# Altium schematic sheet PowerElectronics.SchDoc
size 381 x 241 mm; SheetNumber: 1; SheetTotal: 4
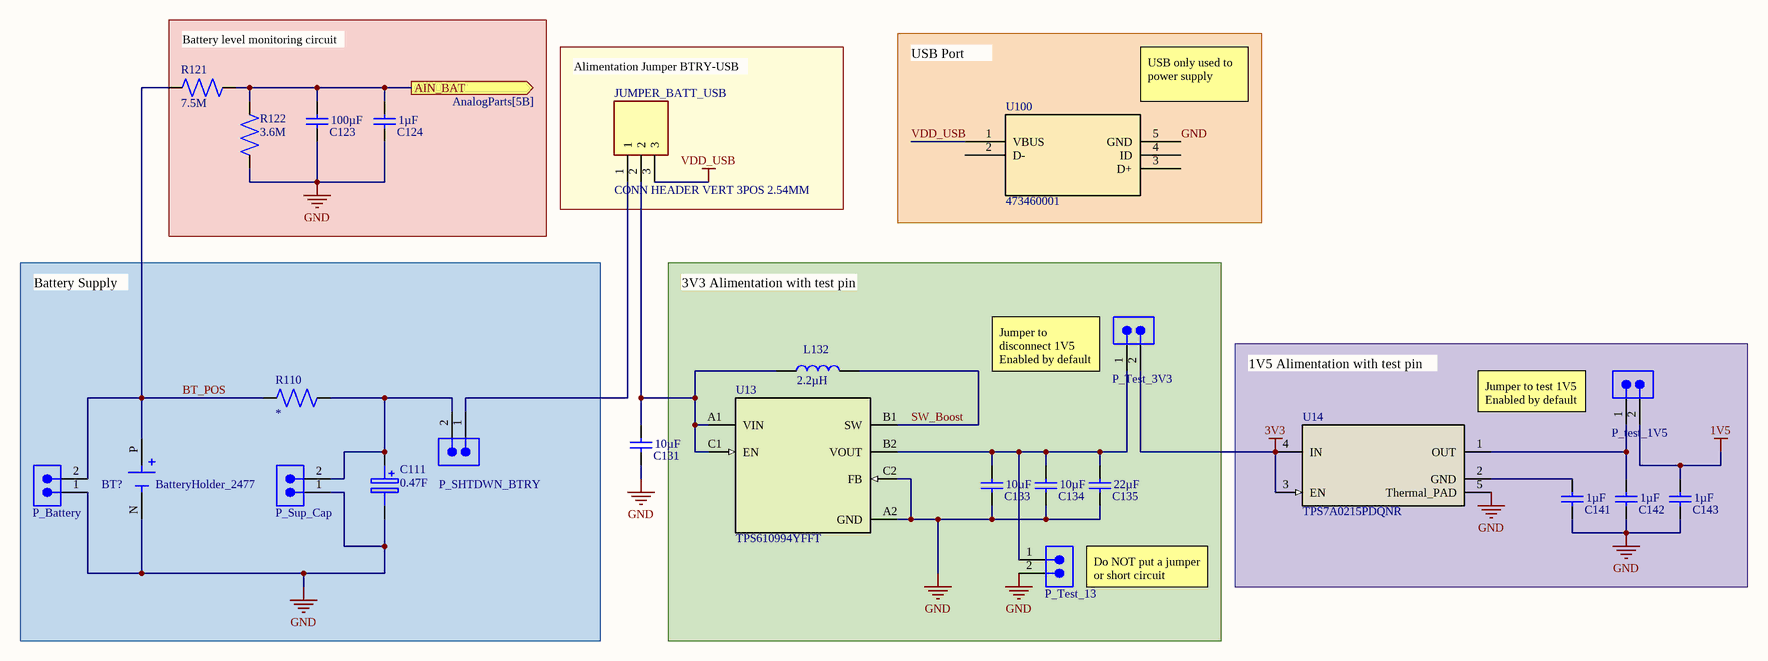
[diagram p0: PowerElectronics.SchDoc]

## Parts
BT?  BatteryHolder_2477  [BatteryHolder2477]
C111  0.47F  [TH_SUPCAP_PHVL3R9V474R]
C123  100µF  [CAPC1608X06L]
C124  1µF  [CAPC1608X06L]
C131  10µF  [CAPC1608X06L]
C133  10µF  [CAPC1608X06L]
C134  10µF  [CAPC1608X06L]
C135  22µF  [CAPC1608X06L]
C141  1µF  [CAPC1608X06L]
C142  1µF  [CAPC1608X06L]
C143  1µF  [CAPC1608X06L]
JUMPER_BATT_USB  CONN HEADER VERT 3POS 2.54MM  [CONN HEADER VERT 3POS 2.54MM]
L132  2.2µH  [INDC2016X10CX]
P_Battery  Pin header 2p  [Pin_header_1x2]  (value not drawn)
P_SHTDWN_BTRY  Pin header 2p  [Pin_header_1x2]  (value not drawn)
P_Sup_Cap  Pin header 2p  [Pin_header_1x2]  (value not drawn)
P_test_1V5  Pin header 2p  [Pin_header_1x2]  (value not drawn)
P_Test_3V3  Pin header 2p  [Pin_header_1x2]  (value not drawn)
P_Test_13  Pin header 2p  [Pin_header_1x2]  (value not drawn)
R110  *  [RESC1608X04.5L]
R121  7.5M  [RESC1608X04.5L]
R122  3.6M  [RESC1608X04.5L]
U13  TPS610994YFFT  [YFF0006AFAD]
U14  TPS7A0215PDQNR  [DQN0004A-MFG]
U100  473460001  [47346-0001_MOL]

## Ports
AIN_BAT (out, see AnalogParts[5B])

## Nets
1V5: C143.2 P_test_1V5.2
3V3: P_Test_3V3.2 U14.3(EN) U14.4(IN)
GND: BT?.N(NEG) C111.1(-) C123.1 C124.1 C131.1 C133.1 C134.1 C135.1 C141.1 C142.1 C143.1 P_Battery.1 P_Sup_Cap.1 P_Test_13.2 R122.2 U13.A2(GND) U13.C2(FB) U14.5(Thermal_PAD) U100.5(GND)
VDD_USB: JUMPER_BATT_USB.3 U100.1(VBUS)
AIN_BAT: C123.2 C124.2 R121.2 R122.1 ; port AIN_BAT
BT_POS: BT?.P(POS) P_Battery.2 R110.1 R121.1
SW_Boost: L132.2 U13.B1(SW)
NetC111_2: C111.2(+) P_SHTDWN_BTRY.2 P_Sup_Cap.2 R110.2
NetC131_2: C131.2 JUMPER_BATT_USB.2 L132.1 U13.A1(VIN) U13.C1(EN)
NetC133_2: C133.2 C134.2 C135.2 P_Test_3V3.1 P_Test_13.1 U13.B2(VOUT)
NetC141_2: C141.2 U14.2(GND)
NetC142_2: C142.2 P_test_1V5.1 U14.1(OUT)
NetJUMPER_BATT_USB_1: JUMPER_BATT_USB.1 P_SHTDWN_BTRY.1

Not connected (* = marked no-connect by the designer): U100 2(D-) 3(D+) 4(ID)

## Notes on the sheet
- (near R121) Battery level monitoring circuit
- Alimentation Jumper BTRY-USB
- USB Port
- (near U100) USB only used to power supply
- Battery Supply
- 3V3 Alimentation with test pin
- (near P_Test_3V3) Jumper to disconnect 1V5
  Enabled by default
- 1V5 Alimentation with test pin
- Jumper to test 1V5
  Enabled by default
- Do NOT put a jumper or short circuit

## Library data of the parts
BT? = BatteryHolder_2477: Battery holder for coin battery, modello BH1000G; Value: BatteryHolder_2477
C111 = PHVL-3R9V474-R: Supercapacitors 0.47F, 3.9V working voltage, 5V surge voltage, 1µA leak current; Value: 0.47F
C123 C124 C131 C133-C135 = C0603-4µ7: Capacitor, X5R, ±10%; Value: 4.7µF
C141-C143 = C0603-4µ7: Capacitor, X5R, ±10%; Value: 1µF
JUMPER_BATT_USB = CONN HEADER VERT 3POS 2.54MM: Connector; Manufacturer_Name: Wurth Elektronik; Manufacturer_Part_Number: 61300311121; Datasheet Link: http://katalog.we-online.de/em/datasheet/6130xx11121.pdf; Height: 8.69mm; Mouser Part Number: 710-61300311121; Mouser Price/Stock: https://www.mouser.co.uk/ProductDetail/Wurth-Elektronik/61300311121?qs=PhR8RmCirEYxRWFJzNKsUw%3D%3D
L132 = L0806-2µ2-1.53A-163mOhm-TDK: Shielded wirewound Inductor 1.53 A 163mOhm, ±20%; MF: TDK Corporation; MP: VLS201610CX-2R2M-1; Check_prices: https://www.snapeda.com/parts/VLS201610CX-2R2M-1/TDK/view-part/?ref=eda; Price: None; Availability: In Stock; SnapEDA_Link: https://www.snapeda.com/parts/VLS201610CX-2R2M-1/TDK/view-part/?ref=snap; Value: 2.2µH; Package: NON STANDARD-2 TDK; Purchase-URL: https://pricing.snapeda.com/search/part/VLS201610CX-2R2M-1/?ref=eda
P_Battery P_SHTDWN_BTRY P_Sup_Cap P_test_1V5 P_Test_3V3 P_Test_13 = Pin header 2p: Pin Header, THT, Vertical, pitch 2.54mm, 1 Row, 2P; Value: Pin header 2p
R110 R121 R122 = R0603: Resistor, ±1%, 0.063W; Value: *
U13 = TPS610994YFFT: No Description Available; Mfr_Name: Texas Instruments; TYPE: TYPE; RefDes: RefDes
U14 = TPS7A0215PDQNR: No Description Available; Mfr_Name: Texas Instruments; TYPE: TYPE; RefDes: RefDes
U100 = 473460001: No Description Available; Mfr_Name: Molex Connector Corporation; RefDes: RefDes; Type: Type